# EasyEDA Pro project ProPrj_25电赛_2025-08-03-final.epro, schematic Schematic4
Board Name: 主控拓展板; Create Date: 2025-07-31; Page Name: P1; Project Name: 25电赛; Schematic Name: Schematic4; Update Date: 2025-07-31; Company: 嘉立创EDA; Page Size: A4; Version: V1.0
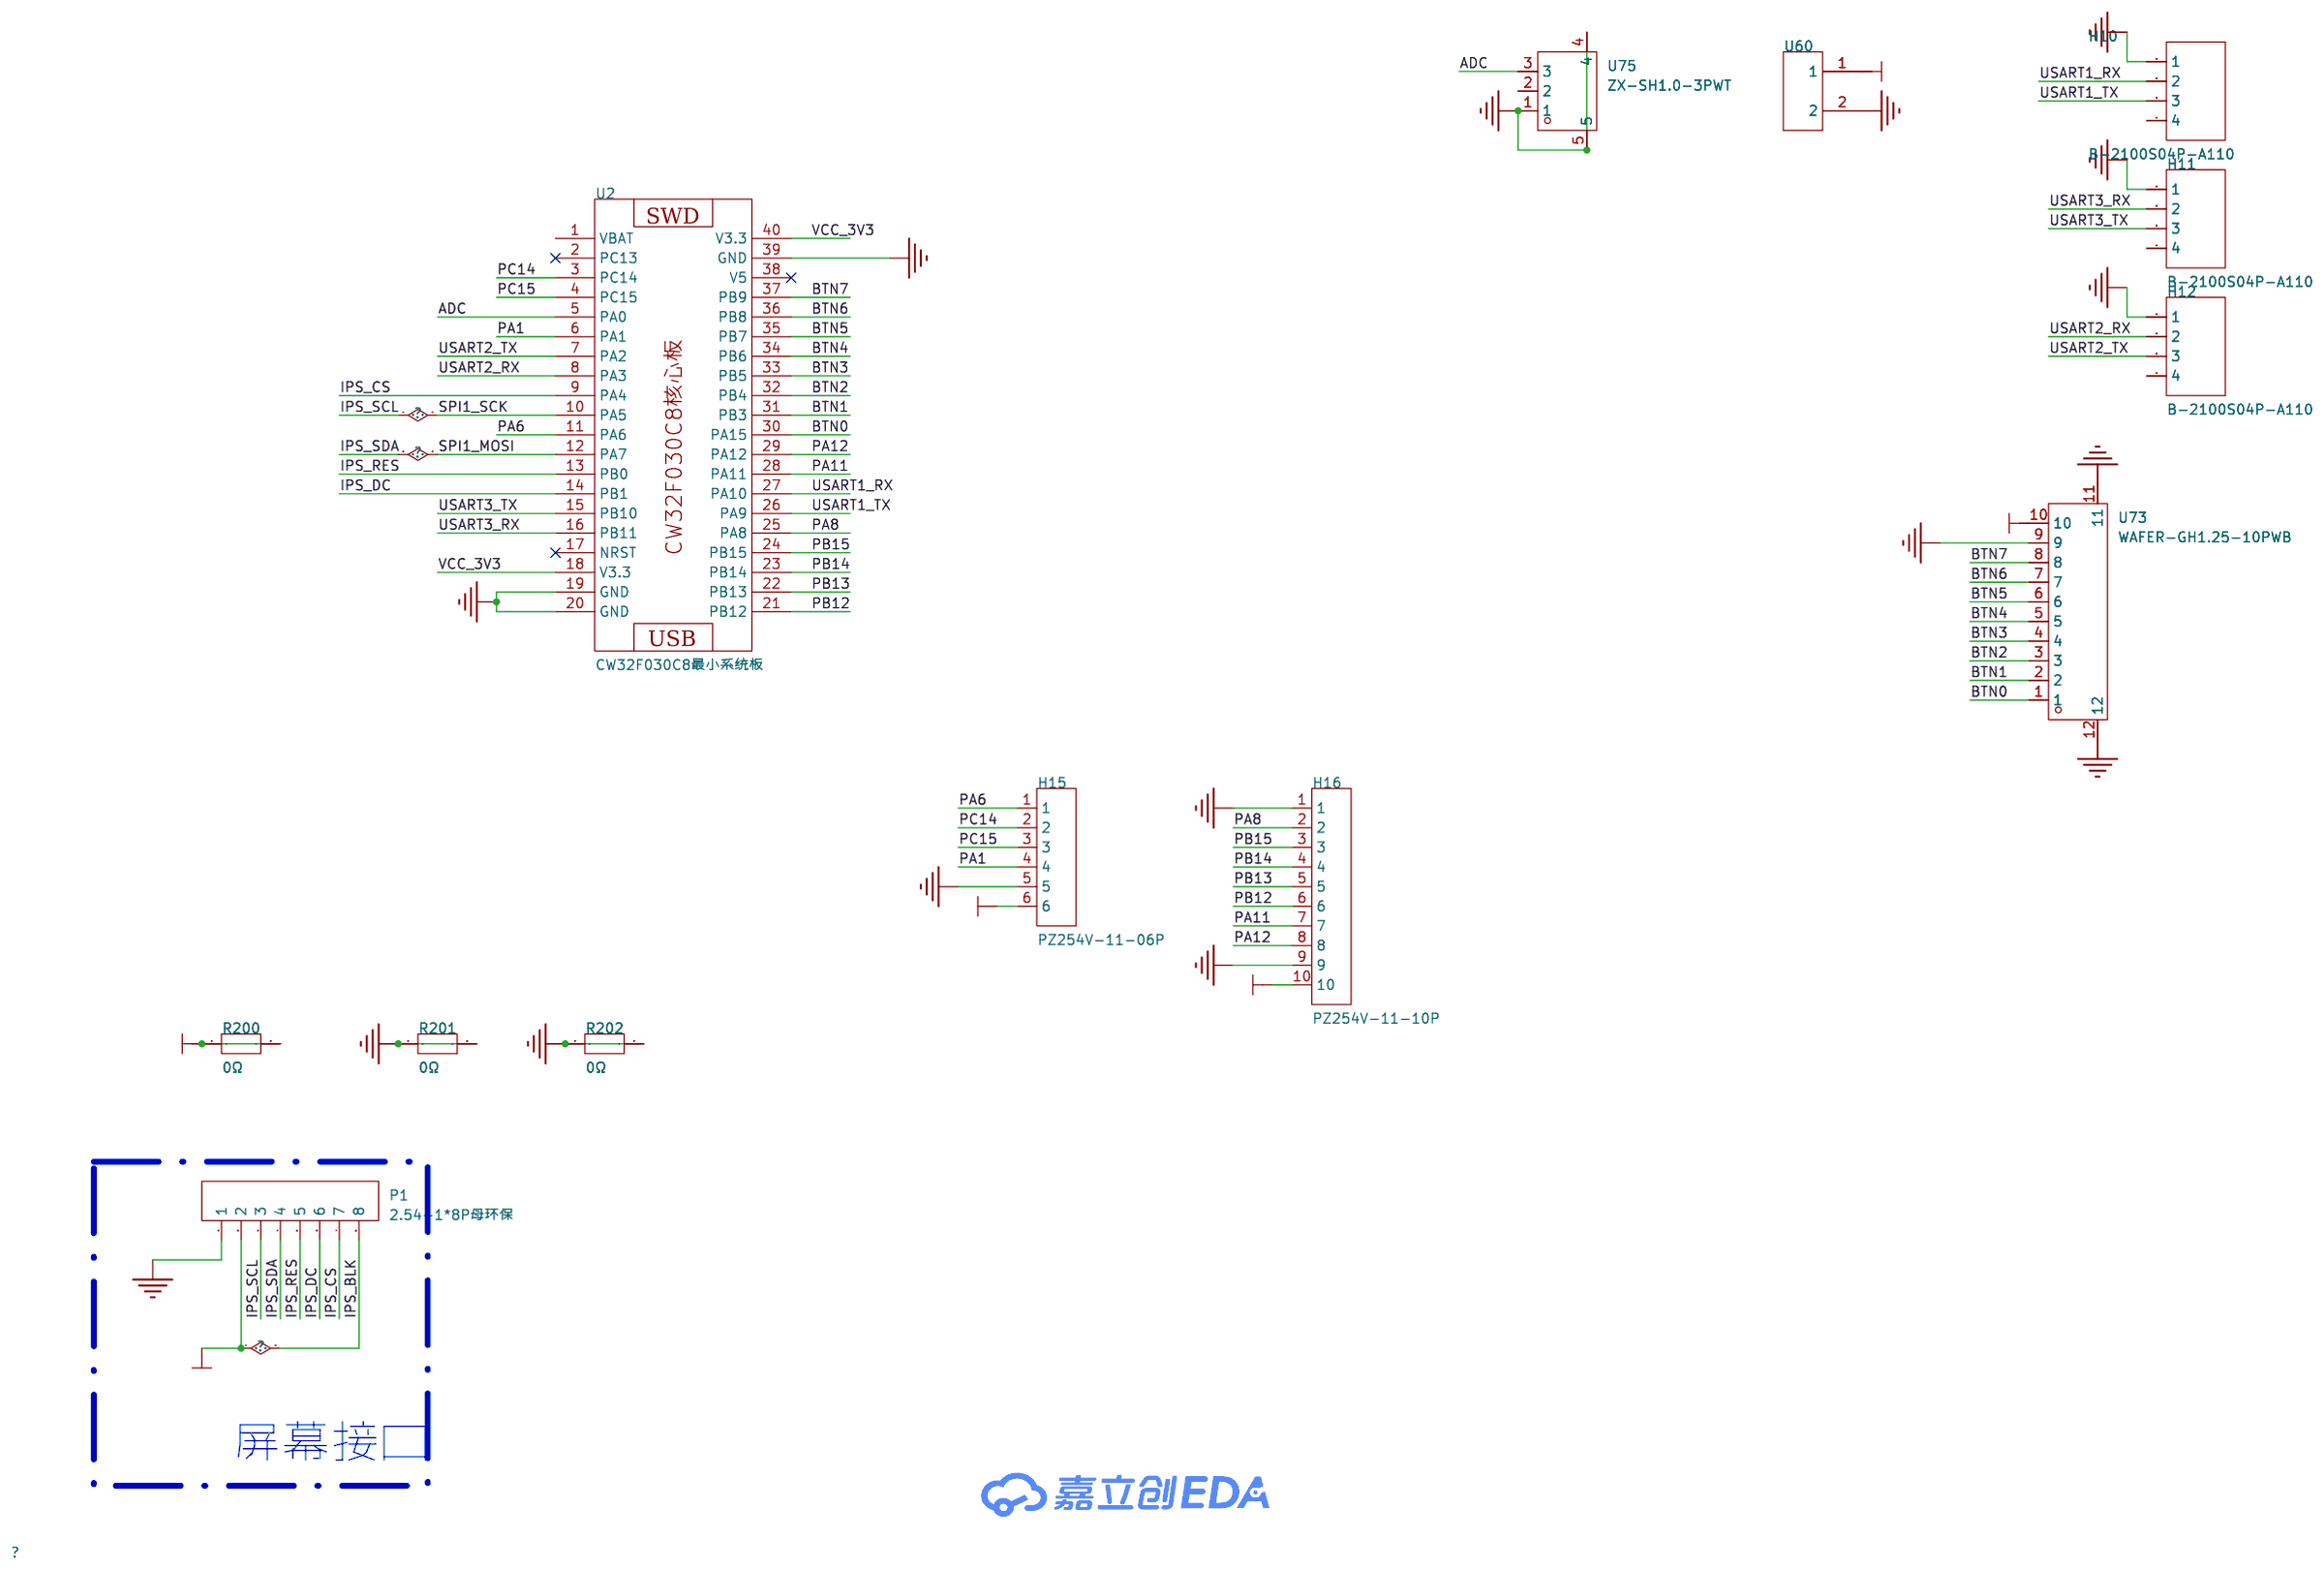
[diagram p2: schematic sheet]

## Parts
H10  B-2100S04P-A110  [HDR-TH_4P-P2.54-V-M]
H11  B-2100S04P-A110  [HDR-TH_4P-P2.54-V-M]
H12  B-2100S04P-A110  [HDR-TH_4P-P2.54-V-M]
H15  PZ254V-11-06P  [HDR-TH_6P-P2.54-V-M]
H16  PZ254V-11-10P  [HDR-TH_10P-P2.54-V-M]
P1  2.54-1*8P母环保  [HDR-TH_8P-P2.54-V-F-1]
R200  0Ω  [R1206]
R201  0Ω  [R1206]
R202  0Ω  [R1206]
U2  CW32F030C8最小系统板  [STM32F103C8T6核心板]
U60  -  [2P焊接端子（大电流）]
U73  WAFER-GH1.25-10PWB  [CONN-SMD_10P-P1.25_XUNPU_WAFER-GH1.25-10PWB]
U75  ZX-SH1.0-3PWT  [CONN-SMD_3P-P1.00_MEGASTAR_ZX-SH1.0-3PWT]

## Library data of the parts
H10-H12 = B-2100S04P-A110: 插针结构:1x4P;间距:2.54mm;行距:-;圆针/方针:-;安装方式:直插;排数:单排;总PIN位数:4P;额定电流:-;额定电压:-;配合针长度:6mm;塑高:2.54mm;端接针长度:3mm;触头材质:黄铜;触头镀层:-;工作温度:-40℃~+105℃;颜色:黑色;; LCSC Part Name: 1x4P 间距:2.54mm 直插; Supplier Part: C124378; Manufacturer: Ckmtw(灿科盟); Supplier Footprint: 插件,P=2.54mm; JLCPCB Part Class: 扩展库; Datasheet: https://atta.szlcsc.com/upload/public/pdf/source/20170821/C124381_1503303309126901535.pdf; Supplier: LCSC; Pin Structure: 1x4P; Pitch: 2.54mm; Mounting Type: 直插; Number of Rows: 单排; Number of Pins: 4P; Length of Mating Pin: 6mm; Insulation Height: 2.54mm; Length of End Connection Pin: 3mm; Contact Material: 黄铜; Operating Temperature: -40℃~+105℃; Color: 黑色
H15 = PZ254V-11-06P: 插针结构:1x6P;间距:2.54mm;行距:-;圆针/方针:方针;安装方式:直插;排数:单排;总PIN位数:6P;额定电流:-;额定电压:-;配合针长度:6mm;塑高:2.5mm;端接针长度:3mm;触头材质:黄铜;触头镀层:-;工作温度:-40℃~+105℃;颜色:黑色;; LCSC Part Name: 1x6P 间距:2.54mm 方针 直插; Supplier Part: C492405; Manufacturer: XFCN(兴飞); Supplier Footprint: 插件,P=2.54mm; JLCPCB Part Class: 扩展库; Datasheet: https://atta.szlcsc.com/upload/public/pdf/source/20200309/C492405_597F1930F5B55CC3C7FD95458F1C3977.pdf; Supplier: LCSC; Pin Structure: 1x6P; Pitch: 2.54mm; Circluar Pins/Square Pins: 方针; Mounting Type: 直插; Number of Rows: 单排; Number of Pins: 6P; Length of Mating Pin: 6mm; Insulation Height: 2.5mm; Length of End Connection Pin: 3mm; Contact Material: 黄铜; Operating Temperature: -40℃~+105℃; Color: 黑色
H16 = PZ254V-11-10P: 插针结构:1x10P;间距:2.54mm;行距:-;圆针/方针:方针;安装方式:直插;排数:单排;总PIN位数:10P;额定电流:-;额定电压:-;配合针长度:6mm;塑高:2.5mm;端接针长度:3mm;触头材质:黄铜;触头镀层:-;工作温度:-40℃~+105℃;颜色:黑色;; LCSC Part Name: 1x10P 间距:2.54mm 方针 直插; Supplier Part: C492409; Manufacturer: XFCN(兴飞); Supplier Footprint: 插件,P=2.54mm; JLCPCB Part Class: 扩展库; Datasheet: https://atta.szlcsc.com/upload/public/pdf/source/20200309/C492409_129C9431BDD62EBBBD0A643B6AAB9FBD.pdf; Supplier: LCSC; Pin Structure: 1x10P; Pitch: 2.54mm; Circluar Pins/Square Pins: 方针; Mounting Type: 直插; Number of Rows: 单排; Number of Pins: 10P; Length of Mating Pin: 6mm; Insulation Height: 2.5mm; Length of End Connection Pin: 3mm; Contact Material: 黄铜; Operating Temperature: -40℃~+105℃; Color: 黑色
P1 = 2.54-1*8P母环保: 插孔结构:1x8P;间距:2.54mm;行距:-;安装类型:直插;排数:单排;总孔位数:8P;塑高:-;触头材质:-;触头镀层:-;; LCSC Part Name: 间距:2.54mm 1x8P 直插; Supplier Part: C27438; Manufacturer: BOOMELE(博穆精密); Supplier Footprint: 插件,P=2.54mm; JLCPCB Part Class: 扩展库; Datasheet: https://atta.szlcsc.com/upload/public/pdf/source/20231221/1CA800C6799ED97958773716FAA1BFFE.pdf; Supplier: LCSC; Holes Structure: 1x8P; Pitch: 2.54mm; Mounting Type: 直插; Number of Rows: 单排; Number of Holes: 8P
R200-R202 = RE1206F1R000: 电阻类型:采样电阻;阻值:0Ω;精度:±1%;功率:1W;; LCSC Part Name: 0mΩ 1W 1206 ±1%; Supplier Part: C46961765; Manufacturer: 捷而瑞; Supplier Footprint: 1206; JLCPCB Part Class: 扩展库; Datasheet: https://atta.szlcsc.com/upload/public/pdf/source/20250325/401775B85EF7B3A580BC34DFED100CB2.pdf; Supplier: LCSC; Type: 采样电阻; Tolerance: ±1%; Power(Watts): 1W
U2 = T6: tags: STM32; Supplier Part: C8734; Manufacturer: 无; Manufacturer Part: STM32F103C8T6最小系统模块; image: http://image.lceda.cn/szlcsc/C8734.jpg; JLCPCB Part Class: Basic Part
U60 = 大电流焊接端子
U73 = WAFER-GH1.25-10PWB: 插针结构:1x10P;间距:1.25mm;安装方式:卧贴;参考系列:GH;总PIN数:10P;排数:1;每排PIN数:10;行距:-;额定电流:1A;触头材质:黄铜;触头镀层:-;工作温度范围:-25℃~+85℃;; LCSC Part Name: 1x10P 间距:1.25mm 卧贴 系列:GH; Supplier Part: C3029385; Manufacturer: XUNPU(讯普); Supplier Footprint: SMD,P=1.25mm,卧贴; JLCPCB Part Class: 扩展库; Datasheet: https://atta.szlcsc.com/upload/public/pdf/source/20220527/CB8773BFB0913C3B8ABD62CB38BA101A.pdf; Supplier: LCSC; Pins Structure: 1x10P; Pitch: 1.25mm; Mounting Type: 卧贴; Reference Series: GH; Number of Pins: 10P; Number of Rows: 1; Number of PINs Per Row: 10; Current Rating: 1A; Contact Material: 黄铜; Operating Temperature: -25℃~+85℃; Voltage Rating: 125V; Plastic Material: LCP; Supplementary Features: 辅助焊脚; Color: 米色; Z-Height of the Board: 4.35mm; X-Length of Bottom Edge on Board (Spacing Line): 15.75mm; Y-Width of Bottom Edge on Board: 5mm
U75 = ZX-SH1.0-3PWT: 插针结构:1x3P;间距:1mm;安装方式:卧贴;参考系列:SH;总PIN数:3P;排数:1;每排PIN数:3;行距:-;额定电流:1A;触头材质:黄铜;触头镀层:锡;工作温度:-;; LCSC Part Name: 1x3P 间距:1mm 卧贴 系列:SH; Supplier Part: C7430445; Manufacturer: Megastar(兆星); Supplier Footprint: SMD,P=1mm,卧贴; JLCPCB Part Class: 扩展库; Datasheet: https://atta.szlcsc.com/upload/public/pdf/source/20230619/CFE52D4011A035D5D140AE40938A4C7D.pdf; Supplier: LCSC; Pins Structure: 1x3P; Pitch: 1mm; Mounting Type: 卧贴; Reference Series: SH; Number of Pins: 3P; Number of Rows: 1; Number of PINs Per Row: 3; Current Rating: 1A; Contact Material: 黄铜; Contact Plating: 锡; Voltage Rating: 50V; Plastic Material: LCP; Supplementary Features: 辅助焊脚; Color: 米色; Z-Height of the Board: 3.15mm; X-Length of Bottom Edge on Board (Spacing Line): 5.35mm; Y-Width of Bottom Edge on Board: 5.05mm

## Nets
GND: H10.1 H11.1 H12.1 H15.5 H16.1 H16.9 P1.1 R201.1 R201.2 R202.1 R202.2 U2.19(GND) U2.20(GND) U2.39(GND) U60.2 U73.9 U73.11 U73.12 U75.1 U75.4 U75.5
VCC_3V3: H15.6 H16.10 P1.2 P1.8 R200.1 R200.2 U2.18(V3.3) U2.40(V3.3) U60.1 U73.10
ADC: U2.5(PA0) U75.3
BTN0: U2.30(PA15) U73.1
BTN1: U2.31(PB3) U73.2
BTN2: U2.32(PB4) U73.3
BTN3: U2.33(PB5) U73.4
BTN4: U2.34(PB6) U73.5
BTN5: U2.35(PB7) U73.6
BTN6: U2.36(PB8) U73.7
BTN7: U2.37(PB9) U73.8
IPS_CS: P1.7 U2.9(PA4)
IPS_DC: P1.6 U2.14(PB1)
IPS_RES: P1.5 U2.13(PB0)
IPS_SCL: P1.3 U2.10(PA5)
IPS_SDA: P1.4 U2.12(PA7)
PA1: H15.4 U2.6(PA1)
PA6: H15.1 U2.11(PA6)
PA8: H16.2 U2.25(PA8)
PA11: H16.7 U2.28(PA11)
PA12: H16.8 U2.29(PA12)
PB12: H16.6 U2.21(PB12)
PB13: H16.5 U2.22(PB13)
PB14: H16.4 U2.23(PB14)
PB15: H16.3 U2.24(PB15)
PC14: H15.2 U2.3(PC14)
PC15: H15.3 U2.4(PC15)
USART1_RX: H10.2 U2.27(PA10)
USART1_TX: H10.3 U2.26(PA9)
USART2_RX: H12.2 U2.8(PA3)
USART2_TX: H12.3 U2.7(PA2)
USART3_RX: H11.2 U2.16(PB11)
USART3_TX: H11.3 U2.15(PB10)

Not connected (* = marked no-connect by the designer): H10 4; H11 4; H12 4; U2 1(VBAT) 2(PC13)* 17(NRST)* 38(V5)*; U75 2

## Notes on the sheet
- 屏幕接口
